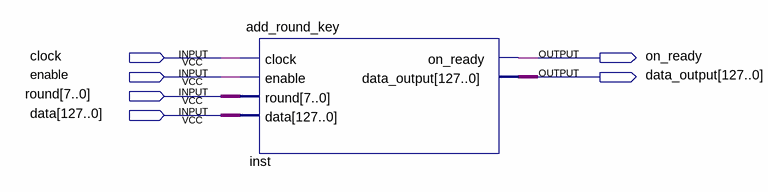
[diagram p0: schematic sheet]
// Quartus schematic decrypt_round.bdf as structural Verilog: 1 symbols, 6 pins
module decrypt_round (
  input  clock,
  input  enable,
  input  [7:0] round,
  input  [127:0] data,
  output on_ready,
  output [127:0] data_output
);

  add_round_key inst (
    .clock(clock), .enable(enable), .round(round), .data(data), .on_ready(on_ready), .data_output(data_output));
endmodule
